# Altium schematic sheet USB_SWITCH_B.SchDoc
size A; SheetNumber: 10; SheetTotal: 12
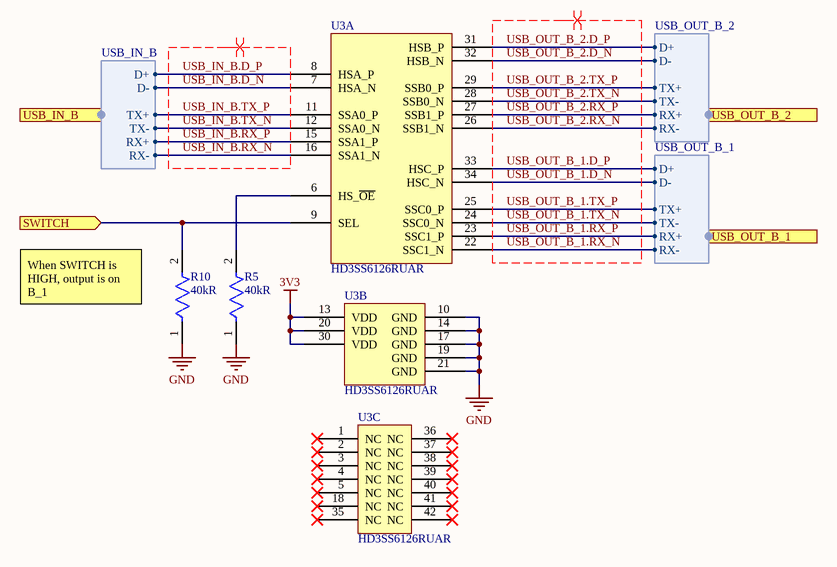
[diagram p0: USB_SWITCH_B.SchDoc]

## Parts
R5  Resistance: 40kR  [FP-CRCW0805-e3-MFG]  (hidden comment: CRCW080540K0FKEA)
R10  Resistance: 40kR  [FP-CRCW0805-e3-MFG]  (hidden comment: CRCW080540K0FKEA)
U3  HD3SS6126RUAR  [QFN50P900X350X80-43N]  (parts A,B,C of 3)

## Ports
SWITCH (in, see USB[2B], HDMI[2B], HDMI_SWITCH[1C], SWITCH[4B], USB[2C], USB_SWITCH_A[1B]), USB_IN_B (harness USB_IN_B, see USB[2B], USB_IN[3B]), USB_OUT_B_1 (harness USB_OUT_B_1, see USB[3B], USB_OUT_B[3B]), USB_OUT_B_2 (harness USB_OUT_B_2, see USB[3B], USB_OUT_B[3B])

## Harnesses
USB_OUT_B_2: TX+, TX-, RX+, RX-, D+, D-
USB_IN_B: TX+, TX-, RX+, RX-, D+, D-
USB_OUT_B_1: TX+, TX-, RX+, RX-, D+, D-

## Nets
3V3: U3.13(VDD) U3.20(VDD) U3.30(VDD)
GND: R5.1 R10.1 U3.10(GND) U3.14(GND) U3.17(GND) U3.19(GND) U3.21(GND)
SWITCH: R10.2 U3.9(SEL) ; port SWITCH
USB_IN_B.D_N: U3.7(HSA_N) ; port USB_IN_B.D-
USB_IN_B.D_P: U3.8(HSA_P) ; port USB_IN_B.D+
USB_IN_B.RX_N: U3.16(SSA1_N) ; port USB_IN_B.RX-
USB_IN_B.RX_P: U3.15(SSA1_P) ; port USB_IN_B.RX+
USB_IN_B.TX_N: U3.12(SSA0_N) ; port USB_IN_B.TX-
USB_IN_B.TX_P: U3.11(SSA0_P) ; port USB_IN_B.TX+
USB_OUT_B_1.D_N: U3.34(HSC_N) ; port USB_OUT_B_1.D-
USB_OUT_B_1.D_P: U3.33(HSC_P) ; port USB_OUT_B_1.D+
USB_OUT_B_1.RX_N: U3.22(SSC1_N) ; port USB_OUT_B_1.RX-
USB_OUT_B_1.RX_P: U3.23(SSC1_P) ; port USB_OUT_B_1.RX+
USB_OUT_B_1.TX_N: U3.24(SSC0_N) ; port USB_OUT_B_1.TX-
USB_OUT_B_1.TX_P: U3.25(SSC0_P) ; port USB_OUT_B_1.TX+
USB_OUT_B_2.D_N: U3.32(HSB_N) ; port USB_OUT_B_2.D-
USB_OUT_B_2.D_P: U3.31(HSB_P) ; port USB_OUT_B_2.D+
USB_OUT_B_2.RX_N: U3.26(SSB1_N) ; port USB_OUT_B_2.RX-
USB_OUT_B_2.RX_P: U3.27(SSB1_P) ; port USB_OUT_B_2.RX+
USB_OUT_B_2.TX_N: U3.28(SSB0_N) ; port USB_OUT_B_2.TX-
USB_OUT_B_2.TX_P: U3.29(SSB0_P) ; port USB_OUT_B_2.TX+
NetR5_2: R5.2 U3.6(HS_~{OE})

Not connected (* = marked no-connect by the designer): U3 1(NC)* 2(NC)* 3(NC)* 4(NC)* 5(NC)* 18(NC)* 35(NC)* 36(NC)* 37(NC)* 38(NC)* 39(NC)* 40(NC)* 41(NC)* 42(NC)*

## Layout directives
differential pair: USB_IN_B.D_N, USB_IN_B.D_P, USB_IN_B.RX_N, USB_IN_B.RX_P, USB_IN_B.TX_N, USB_IN_B.TX_P, USB_OUT_B_1.D_N, USB_OUT_B_1.D_P, USB_OUT_B_1.RX_N, USB_OUT_B_1.RX_P, USB_OUT_B_1.TX_N, USB_OUT_B_1.TX_P, USB_OUT_B_2.D_N, USB_OUT_B_2.D_P, USB_OUT_B_2.RX_N, USB_OUT_B_2.RX_P, USB_OUT_B_2.TX_N, USB_OUT_B_2.TX_P

## Notes on the sheet
- (near R10) When SWITCH is HIGH, output is on B_1

## Library data of the parts
R5 R10 = CMP-02407-003498-1: RES Thick Film, 40kΩ, 1%, 0.125W, 100ppm/°C, 0805; Max Power Dissipation: 125mW; Tolerance: 1%; Features: Automotive AEC-Q200; Max Operating Temperature: 155°C; Composition: Thick Film; Length: 0.079inch; Case/Package: 0805; Min Operating Temperature: -55°C; Packaging: Tape and Reel; Number of Terminations: 2; Width: 0.049inch; Height: 0.02inch; Package Quantity: 5000; Lead Free: Lead Free; Temperature Coefficient: 100ppm/°C
U3 = HD3SS6126RUAR: High Speed Differential Switch 2: 1/1: 2 MUX/DEMUX USB 2.0/USB 3.0 3.3V T/R 42-Pin WQFN EP